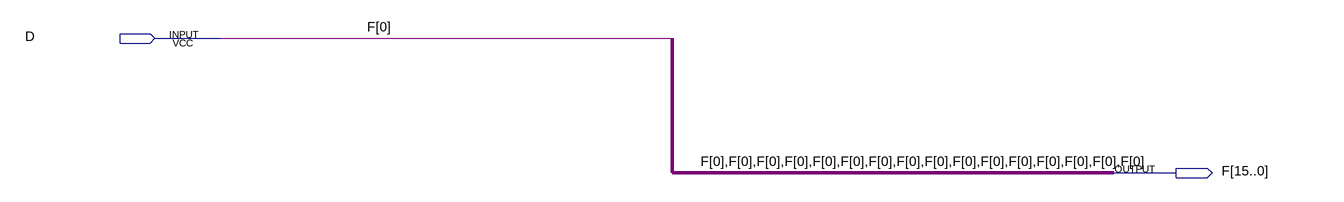
[diagram p0: schematic sheet]
// Quartus schematic OneTo16Bits.bdf as structural Verilog: 0 symbols, 2 pins
module OneTo16Bits (
  input  D,
  output [15:0] F
);


  assign F[0] = D;
endmodule
